# EasyEDA Pro project Dual_ESC_6-24V_3.7A_V1_Easy_EDA.epro

# Schematic Schematic1
Board Name: Board1; Create Date: 2025-12-29; Page Name: P1; Project Name: Dual ESC; Schematic Name: Schematic1; Update Date: 2026-02-05; Company: EasyEDA.com; Page Size: A4; Version: V1.0
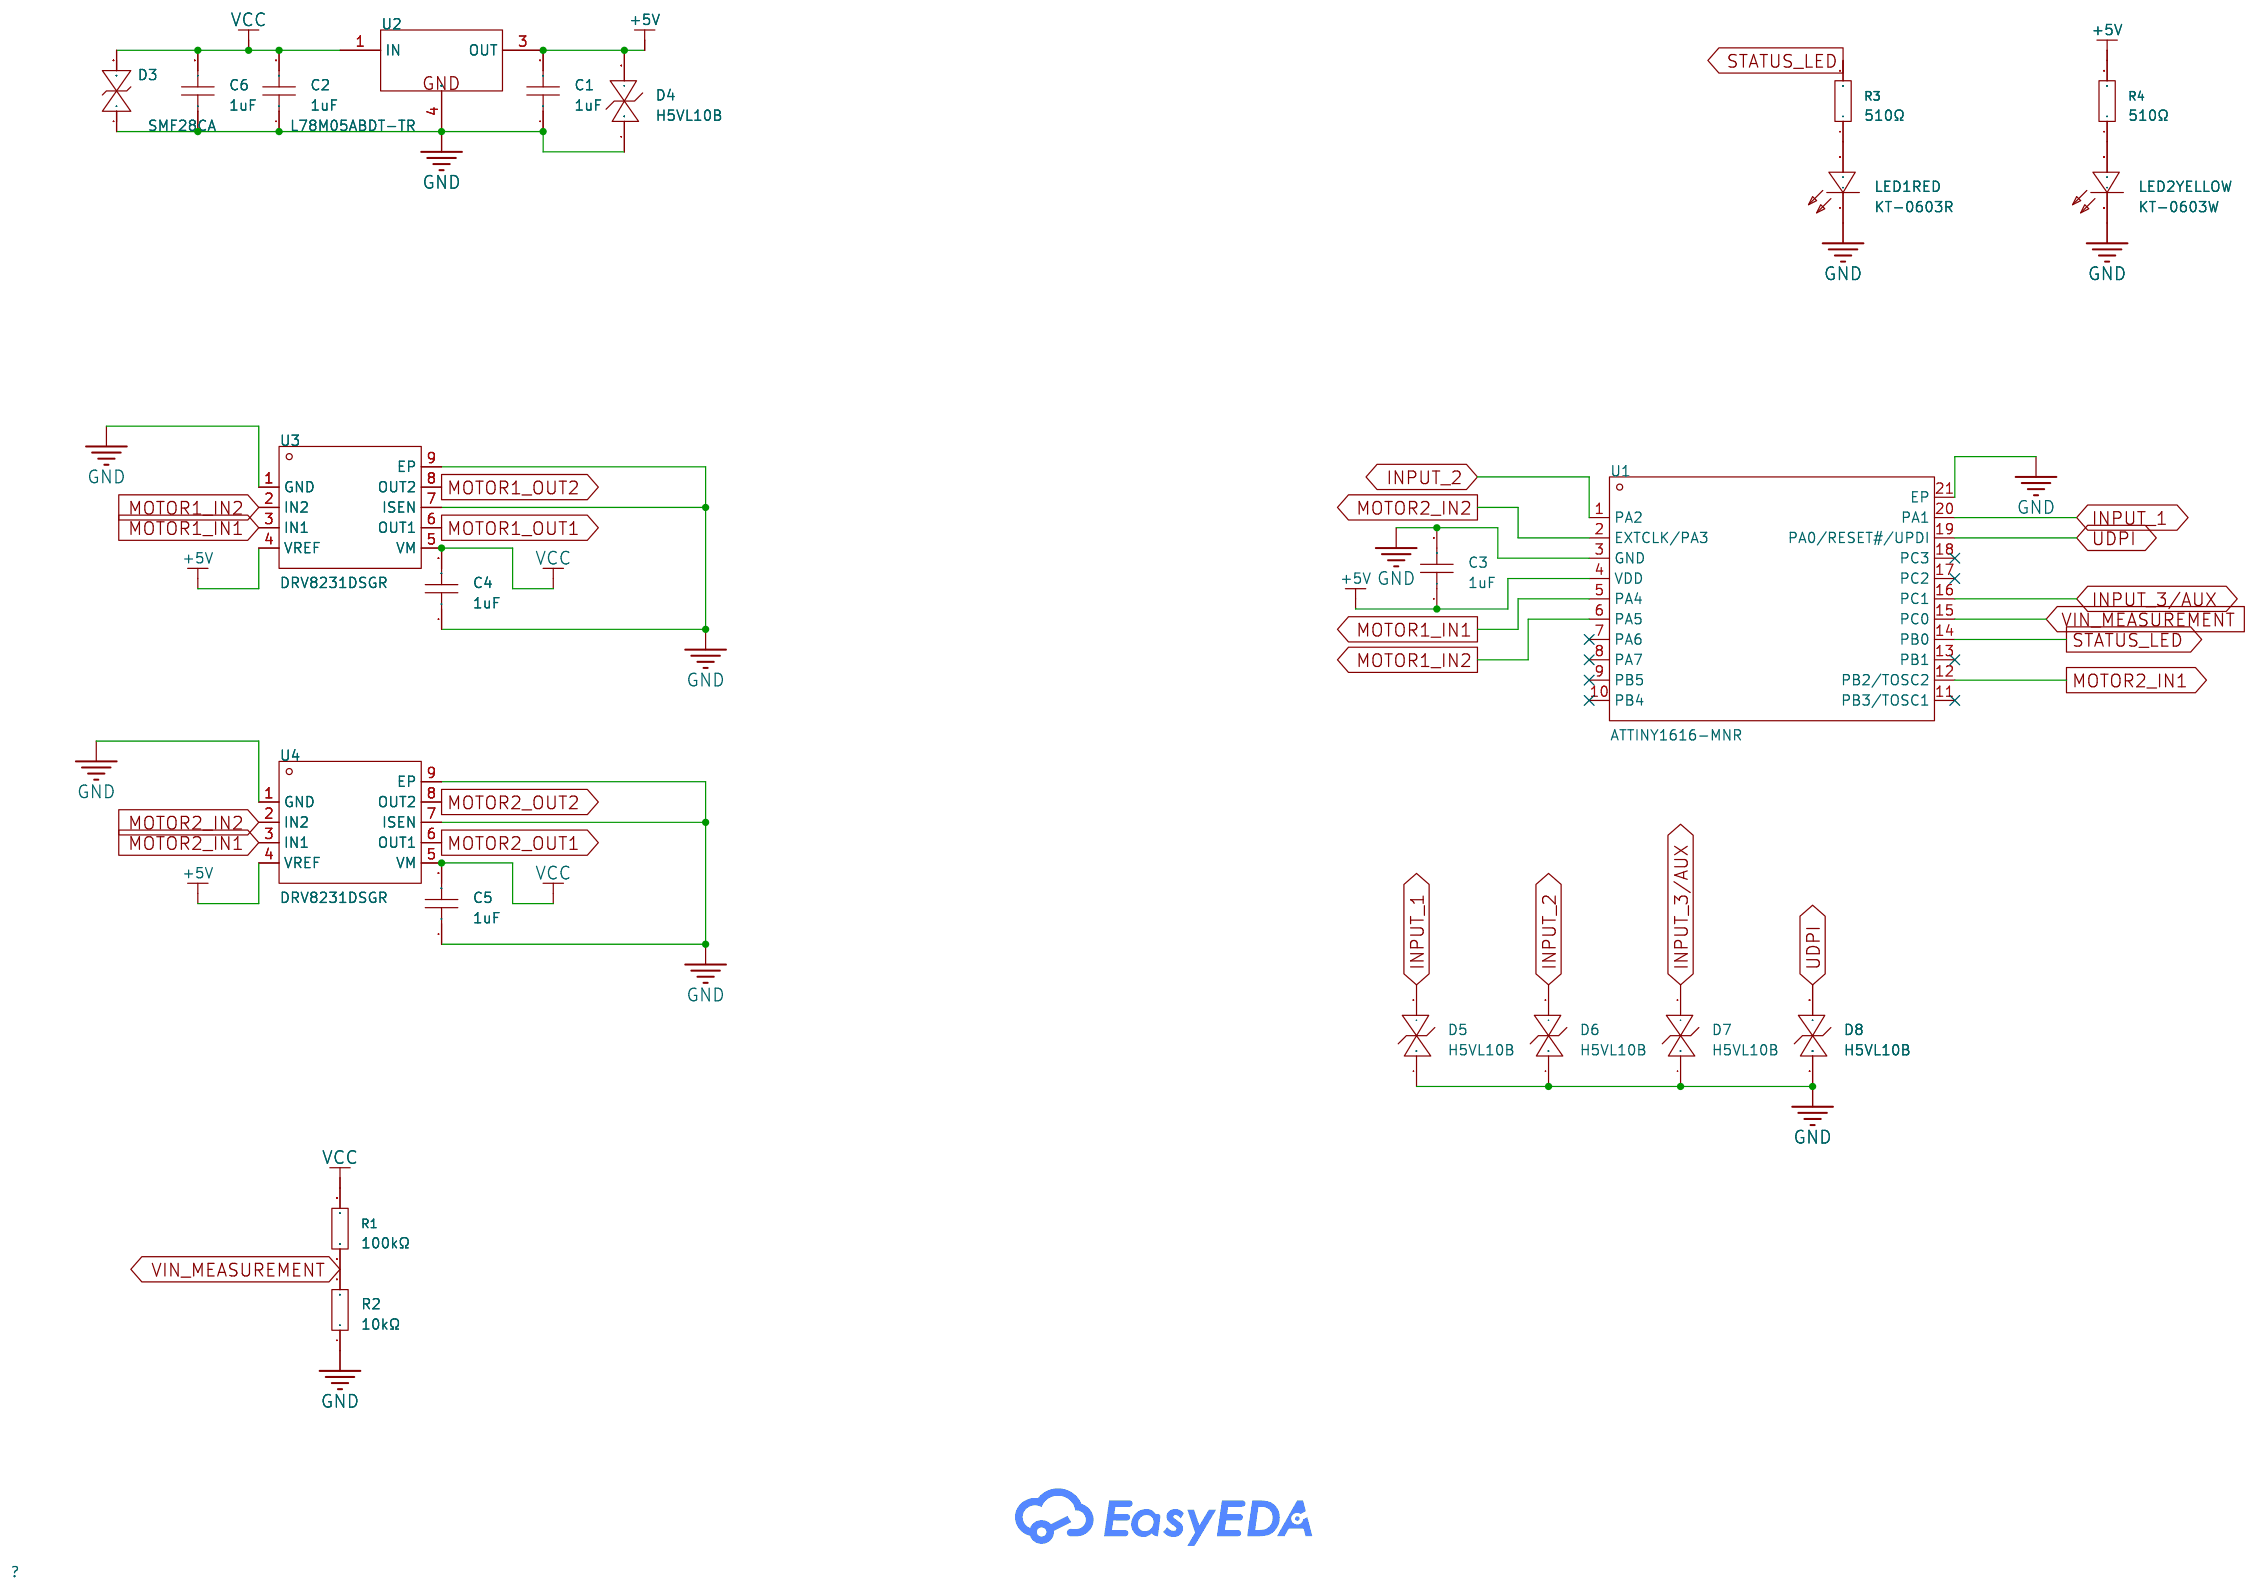
[diagram p0: schematic sheet]

## Parts
C1  1uF  [C0402]
C2  1uF  [C0603]
C3  1uF  [C0402]
C4  1uF  [C0603]
C5  1uF  [C0603]
C6  1uF  [C0603]
D3  SMF28CA  [SOD-123FL_L2.7-W1.8-LS3.8-BI]
D4  H5VL10B  [SOD-882_L1.0-W0.6-BI]
D5  H5VL10B  [SOD-882_L1.0-W0.6-BI]
D6  H5VL10B  [SOD-882_L1.0-W0.6-BI]
D7  H5VL10B  [SOD-882_L1.0-W0.6-BI]
D8  H5VL10B  [SOD-882_L1.0-W0.6-BI]
LED1RED  KT-0603R  [LED0603-RD]
LED2YELLOW  KT-0603W  [LED0603-R-RD_WHITE]
R1  100kΩ  [R0402]
R2  10kΩ  [R0402]
R3  510Ω  [R0402]
R4  510Ω  [R0402]
U1  ATTINY1616-MNR  [QFN-20_L3.0-W3.0-P0.40-BL-EP1.7]
U2  L78M05ABDT-TR  [TO-252-2_L6.5-W6.1-P4.58-LS10.0-TL]
U3  DRV8231DSGR  [WSON-8_L2.0-W2.0-P0.50-TL-EP]
U4  DRV8231DSGR  [WSON-8_L2.0-W2.0-P0.50-TL-EP]

## Library data of the parts
C1 C3 = CL05A105KA5NQNC: Capacitance:1uF Tolerance:±10% Tolerance:±10% Voltage Rating:25V Temperature Coefficient:X5R; LCSC Part Name: 1uF ±10% 25V; Supplier Part: C52923; Manufacturer: SAMSUNG(三星); Supplier Footprint: 0402; JLCPCB Part Class: Basic Part; Datasheet: https://item.szlcsc.com/datasheet/CL05A105KA5NQNC/53938.html; Supplier: LCSC; Tolerance: ±10%; Voltage Rating: 25V; Temperature Coefficient: X5R
C2 C4-C6 = CL10A105KB8NNNC: Capacitance:1uF Tolerance:±10% Tolerance:±10% Voltage Rating:50V Temperature Coefficient:X5R; LCSC Part Name: 1uF ±10% 50V; Supplier Part: C15849; Manufacturer: SAMSUNG(三星); Supplier Footprint: 0603; JLCPCB Part Class: Basic Part; Datasheet: https://item.szlcsc.com/datasheet/CL10A105KB8NNNC/16531.html; Supplier: LCSC; Tolerance: ±10%; Voltage Rating: 50V; Temperature Coefficient: X5R
D3 = SMF28CA_C19077517: Polarity:Bidirectional Reverse Stand-Off Voltage (Vrwm):28V Clamping Voltage:45.4V Peak Pulse Current (Ipp):4.4A@10/1000us Peak Pulse Power Dissipation (Ppp):200W@10/1000us Voltage - Breakdown:34.4V Reverse Leakage Current (Ir):1uA Operating Temperature:-; LCSC Part Name: 双向TVS 28V截止 峰值浪涌电流：4.4A@10/1000us; Supplier Part: C19077517; Manufacturer: R+O(宏嘉诚); Supplier Footprint: SOD-123FL; JLCPCB Part Class: Extended Part; Datasheet: https://item.szlcsc.com/datasheet/SMF28CA/20275602.html; Supplier: LCSC; Polarity: Bidirectional; Reverse Stand-Off Voltage (Vrwm): 28V; Clamping Voltage: 45.4V; Peak Pulse Current (Ipp): 4.4A@10/1000us; Peak Pulse Power Dissipation (Ppp): 200W@10/1000us; Voltage - Breakdown: 34.4V; Reverse Leakage Current (Ir): 1uA; Operating Temperature: -55℃~+150℃; level of protection: IEC 61000-4-2; Type: TVS
D4-D8 = H5VL10B: Polarity:Bidirectional Reverse Stand-Off Voltage (Vrwm):5V Clamping Voltage:10V Peak Pulse Current (Ipp):5A Peak Pulse Power Dissipation (Ppp):50W Voltage - Breakdown:5.6V Reverse Leakage Current (Ir):100nA Number of Channels:1 Operating Temperature:-55℃~; LCSC Part Name: 丝印 PB 双向ESD 5V截止 峰值浪涌电流：5A; Supplier Part: C7420372; Manufacturer: R+O(宏嘉诚); Supplier Footprint: DFN1006-2L; JLCPCB Part Class: Extended Part; Datasheet: https://item.szlcsc.com/datasheet/H5VL10B/8397194.html; Supplier: LCSC; Polarity: Bidirectional; Reverse Stand-Off Voltage (Vrwm): 5V; Clamping Voltage: 10V; Peak Pulse Current (Ipp): 5A; Peak Pulse Power Dissipation (Ppp): 50W; Voltage - Breakdown: 5.6V; Reverse Leakage Current (Ir): 100nA; Number of Channels: 1; Operating Temperature: -55℃~+125℃; level of protection: IEC 61000-4-2；IEC 61000-4-5; Type: ESD; Junction Capacitance: 15pF
LED1RED = KT-0603R: Emitted Color:Red Power Dissipation:- Forward Current:- Dominant Wavelength:- Dominant Wavelength:- Peak Wavelength:- Diode Configuration:- Lens Color:- Color Temperature:- Color Temperature:- Viewing Angle:- Mounting Sytle:- Operating Temperature:-40℃~+8; LCSC Part Name: 0603 红灯 高亮; Supplier Part: C2286; Manufacturer: KENTO; Supplier Footprint: 0603; JLCPCB Part Class: Basic Part; Datasheet: https://atta.szlcsc.com/upload/public/pdf/source/20160616/1466072038404.pdf; Supplier: LCSC; Emitted Color: Red; Operating Temperature: -40℃~+85℃
LED2YELLOW = KT-0603W: Illumination Color:White Voltage - Forward(Vf):2.6V~3.1V Voltage - Forward(Vf):2.6V~3.1V Power(Watts):100mW Forward Current:5mA Diode Configuration:Discrete Diode Lens Color:Yellow Lens Luminous Intensity:360mcd Luminous Intensity:360mcd Viewing Angle:120; LCSC Part Name: 0603 白灯 高亮; Supplier Part: C2290; Manufacturer: KENTO; Supplier Footprint: 0603; JLCPCB Part Class: Basic Part; Datasheet: https://item.szlcsc.com/datasheet/KT-0603W/2663.html; Supplier: LCSC; Illumination Color: White; Voltage - Forward(Vf): 2.6V~3.1V; Power(Watts): 100mW; Forward Current: 5mA; Diode Configuration: Discrete Diode; Lens Color: Yellow Lens; Luminous Intensity: 360mcd; Viewing Angle: 120°; Mounting Style: Top-mount
R1 = 0402WGF1003TCE: Type:Thick Film Resistor Resistance:100kΩ Tolerance:±1% Tolerance:±1% Power(Watts):62.5mW Voltage-Supply(Max):50V Temperature Coefficient:±100ppm/℃ Temperature Coefficient:±100ppm/℃ Operating Temperature:-55℃~+155℃ Operating Temperature:-55℃~+155℃; LCSC Part Name: 100kΩ ±1% 62.5mW 厚膜电阻; Supplier Part: C25741; Manufacturer: UNI-ROYAL(厚声); Supplier Footprint: 0402; JLCPCB Part Class: Basic Part; Datasheet: https://item.szlcsc.com/datasheet/0402WGF1003TCE/26484.html; Supplier: LCSC; Type: Thick Film Resistor; Tolerance: ±1%; Power(Watts): 62.5mW; Voltage-Supply(Max): 50V; Temperature Coefficient: ±100ppm/℃; Operating Temperature: -55℃~+155℃
R2 = 0402WGF1002TCE: Type:Thick Film Resistor Resistance:10kΩ Tolerance:±1% Tolerance:±1% Power(Watts):62.5mW Voltage-Supply(Max):50V Temperature Coefficient:±100ppm/℃ Temperature Coefficient:±100ppm/℃ Operating Temperature:-55℃~+155℃ Operating Temperature:-55℃~+155℃; LCSC Part Name: 10kΩ ±1% 62.5mW 厚膜电阻; Supplier Part: C25744; Manufacturer: UNI-ROYAL(厚声); Supplier Footprint: 0402; JLCPCB Part Class: Basic Part; Datasheet: https://item.szlcsc.com/datasheet/0402WGF1002TCE/26487.html; Supplier: LCSC; Type: Thick Film Resistor; Tolerance: ±1%; Power(Watts): 62.5mW; Voltage-Supply(Max): 50V; Temperature Coefficient: ±100ppm/℃; Operating Temperature: -55℃~+155℃
R3 R4 = 0402WGF5100TCE: Type:Thick Film Resistor Resistance:510Ω Tolerance:±1% Tolerance:±1% Power(Watts):62.5mW Voltage-Supply(Max):50V Temperature Coefficient:±100ppm/℃ Temperature Coefficient:±100ppm/℃ Operating Temperature:-55℃~+155℃ Operating Temperature:-55℃~+155℃; LCSC Part Name: 510Ω ±1% 62.5mW 厚膜电阻; Supplier Part: C25123; Manufacturer: UNI-ROYAL(厚声); Supplier Footprint: 0402; JLCPCB Part Class: Basic Part; Datasheet: https://item.szlcsc.com/datasheet/0402WGF5100TCE/25866.html; Supplier: LCSC; Type: Thick Film Resistor; Tolerance: ±1%; Power(Watts): 62.5mW; Voltage-Supply(Max): 50V; Temperature Coefficient: ±100ppm/℃; Operating Temperature: -55℃~+155℃
U1 = ATTINY1616-MNR: CPU Core:AVR CPU Maximum Speed:20MHz Program Storage Size:16KB Program Memory Type:FLASH Number of I/O:18 ADC (Bit):10bit DAC (Bit):8bit Voltage - Supply:1.8V~5.5V Voltage - Supply:1.8V~5.5V Applications:-; LCSC Part Name: tinyAVR 1系列处理器; Supplier Part: C507118; Manufacturer: MICROCHIP(美国微芯); Supplier Footprint: QFN-20-EP(3x3); JLCPCB Part Class: Extended Part; Datasheet: https://item.szlcsc.com/datasheet/ATTINY1616-MNR/520766.html; Supplier: LCSC; CPU Core: AVR; CPU Maximum Speed: 20MHz; Program Storage Size: 16KB; Program Memory Type: FLASH; Number of I/O: 18; ADC (Bit): 10bit; DAC (Bit): 8bit; Voltage - Supply: 1.8V~5.5V
U2 = L78M05ABDT-TR: Output Type:Fixed Maximum Input Voltage:35V Output Voltage:5V Output Voltage:5V Output Current:500mA Power Supply Rejection Ratio (PSRR):62dB@(120Hz) Dropout Voltage:- standby current:6mA Feature:Short-Circuit  Protection；Thermal Protection(TSD)；Overcurre; LCSC Part Name: 精密500 mA稳压器; Supplier Part: C58069; Manufacturer: ST(意法半导体); Supplier Footprint: TO-252-2(DPAK); JLCPCB Part Class: Basic Part; Datasheet: https://atta.szlcsc.com/upload/public/pdf/source/20230728/311D30A65517FCBD6FE5D1CCA2CA8430.pdf; Supplier: LCSC; Output Type: Fixed; Maximum Input Voltage: 35V; Output Voltage: 5V; Output Current: 500mA; Power Supply Rejection Ratio (PSRR): 62dB@(120Hz); standby current: 6mA; Feature: Short-Circuit  Protection；Thermal Protection(TSD)；Overcurrent Protection(OCP); Operating Temperature: -40℃~+125℃; Output Polarity: Positive electrode; Number of Outputs: 1
U3 U4 = DRV8231DSGR: Technology:Yes Number of H-bridges:1 Peak Current:3.7A Voltage - Supply:4.5V~33V Voltage - Supply:4.5V~33V RDS(on):600mΩ Quiescent Current(Iq):1uA Operating Temperature:-40℃~+125℃ Operating Temperature:-40℃~+125℃; LCSC Part Name: 3.7A 有刷直流电机驱动芯片 33V; Supplier Part: C3681197; Manufacturer: TI(德州仪器); Supplier Footprint: WSON-8(2x2); JLCPCB Part Class: Extended Part; Datasheet: https://www.ti.com/cn/lit/gpn/drv8231; Supplier: LCSC; Technology: Yes; Number of H-bridges: 1; Peak Current: 3.7A; Voltage - Supply: 4.5V~33V; RDS(on): 600mΩ; Quiescent Current(Iq): 1uA; Operating Temperature: -40℃~+125℃

## Nets
+5V: C1.2 C3.1 D4.2(A) R4.2 U1.4(VDD) U2.3(OUT) U3.4(VREF) U4.4(VREF)
GND: C1.1 C2.1 C3.2 C4.1 C5.1 C6.1 D3.1 D4.1(C) D5.1(C) D6.1(C) D7.1(C) D8.1(C) LED1RED.1(K) LED2YELLOW.2(K) R2.1 U1.3(GND) U1.21(EP) U2.4(GND) U3.1(GND) U3.7(ISEN) U3.9(EP) U4.1(GND) U4.7(ISEN) U4.9(EP)
VCC: C2.2 C4.2 C5.2 C6.2 D3.2 R1.2 U2.1(IN) U3.5(VM) U4.5(VM)
VIN_MEASUREMENT: R1.1 R2.2 U1.15(PC0)
INPUT_1: D5.2(A) U1.20(PA1)
INPUT_2: D6.2(A) U1.1(PA2)
INPUT_3/AUX: D7.2(A) U1.16(PC1)
MOTOR1_IN1: U1.5(PA4) U3.3(IN1)
MOTOR1_IN2: U1.6(PA5) U3.2(IN2)
MOTOR1_OUT1: U3.6(OUT1)
MOTOR1_OUT2: U3.8(OUT2)
MOTOR2_IN1: U1.12(PB2/TOSC2) U4.3(IN1)
MOTOR2_IN2: U1.2(EXTCLK/PA3) U4.2(IN2)
MOTOR2_OUT1: U4.6(OUT1)
MOTOR2_OUT2: U4.8(OUT2)
STATUS_LED: R3.2 U1.14(PB0)
UDPI: D8.2(A) U1.19(PA0/RESET#/UPDI)
$1N1764: LED1RED.2(A) R3.1
$1N1846: LED2YELLOW.1(A) R4.1

Not connected (* = marked no-connect by the designer): U1 7(PA6)* 8(PA7)* 9(PB5)* 10(PB4)* 11(PB3/TOSC1)* 13(PB1)* 17(PC2)* 18(PC3)*

# Board PCB1
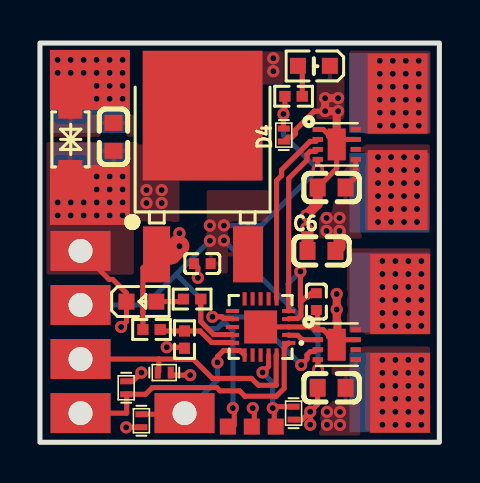
[diagram p1: board, top side]
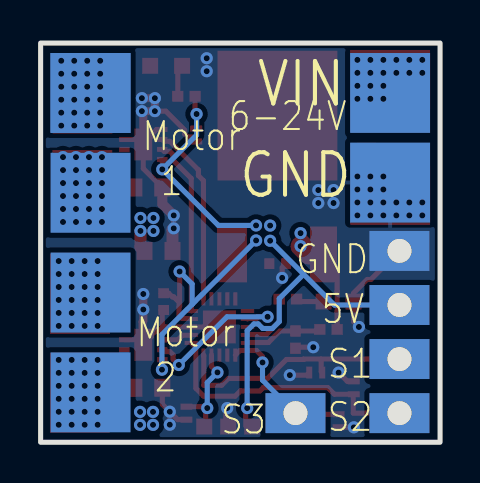
[diagram p2: board, bottom side, seen from below]

Outline 20 x 20 mm; copper layers: Top Layer, Inner1, Inner2, Bottom Layer. Coordinates in mm from the lower left corner of the outline.
Outline path: rectangle 0,20 20,0
Stack: Top Layer 0.035mm Outer layer thickness 1oz / Dielectric1 0.2104mm 7628 RC49% 8.6mil / Inner1 0.0152mm Inner layer thickness / Dielectric2 1.065mm 1.1mm H/HOZ Copper / Inner2 0.0152mm Inner layer thickness / Dielectric3 0.2104mm 7628 RC49% 8.6mil / Bottom Layer 0.035mm Outer layer thickness 1oz

## Design rules (mm)
template: Custom Config
spacing copperThickness1oz (default): track to track 0.102, other pairs 0.152 to 0.3
spacing copperThickness2oz: track to track 0.203, other pairs 0.152 to 0.3
track width copperThickness1oz (default): min 0.127, default 0.254, max 2.54
track width copperThickness2oz: min 0.203, default 0.254, max 2.54
differential pair differentialPair (default): width min 0.127, default 0.254, max 2.54; gap min 0.152, default 0.152
via viaSize (default): diameter min 0.5, default 0.61, max 10; hole min 0.3, default 0.305, max 6.3
net MOTOR1_OUT1 uses Motor_Outputs
net MOTOR1_OUT2 uses Motor_Outputs
net MOTOR2_OUT1 uses Motor_Outputs
net MOTOR2_OUT2 uses Motor_Outputs
pour e164 uses Motor_Outputs
pour e17 uses Motor_Outputs

## Placement (name value [footprint] x y rotation side)
C1  1uF  [C0402]  8.13 8.95 0 top
C2  1uF  [C0603]  3.68 15.3 90 top
C3  1uF  [C0402]  13.84 7.05 270 top
C4  1uF  [C0603]  14.6 12.76 0 top
C5  1uF  [C0603]  14.6 2.73 0 top
C6  1uF  [C0603]  14.1 9.59 0 top
D3  SMF28CA  [SOD-123FL_L2.7-W1.8-LS3.8-BI]  1.52 15.17 90 top
D4  H5VL10B  [SOD-882_L1.0-W0.6-BI]  12.21 15.39 90 top
D5  H5VL10B  [SOD-882_L1.0-W0.6-BI]  6.22 3.49 180 top
D6  H5VL10B  [SOD-882_L1.0-W0.6-BI]  4.32 2.73 270 top
D7  H5VL10B  [SOD-882_L1.0-W0.6-BI]  5.08 1.08 90 top
D8  H5VL10B  [SOD-882_L1.0-W0.6-BI]  12.7 1.46 90 top
LED1RED  KT-0603R  [LED0603-RD]  5.08 7.05 0 top
LED2YELLOW  KT-0603W  [LED0603-R-RD_WHITE]  13.72 18.86 180 top
NOREF  -  [Pad_e862]  17.91 12.63 0 top
NOREF#2  -  [Pad_e148]  2.03 9.59 0 top
NOREF#3  -  [Pad_e894]  9.41 0.78 0 top
NOREF#4  -  [Pad_e864]  18.03 2.47 0 top
NOREF#5  -  [Pad_e143]  17.5 12.5 0 top
NOREF#6  -  [Pad_e145]  17.5 7.5 0 top
NOREF#7  -  [Pad_e144]  17.5 2.5 0 top
NOREF#8  -  [Pad_e863]  18.03 7.43 0 top
NOREF#9  -  [Pad_e153]  2.03 4.17 0 top
NOREF#10  -  [Pad_e513]  2.5 18.16 0 top
NOREF#11  -  [Pad_e141]  17.5 17.5 0 top
NOREF#12  -  [Pad_e152]  2.03 6.88 0 top
NOREF#13  -  [Pad_e896]  10.61 0.78 0 top
NOREF#14  -  [Pad_e146]  2.5 17.5 0 top
NOREF#15  -  [Pad_e897]  11.81 0.78 0 top
NOREF#16  -  [Pad_e155]  7.24 1.46 0 top
NOREF#17  -  [Pad_e154]  2.03 1.46 0 top
NOREF#18  -  [Pad_e847]  17.5 17.5 0 top
NOREF#19  -  [Pad_e147]  2.5 13.01 0 top
NOREF#20  -  [Pad_e861]  17.91 17.46 0 top
NOREF#21  -  [Pad_e515]  2.5 12.39 0 top
R1  100kΩ  [R0402]  5.59 5.65 180 top
R2  10kΩ  [R0402]  7.24 5.14 90 top
R3  510Ω  [R0402]  7.62 7.17 0 top
R4  510Ω  [R0402]  12.7 17.33 180 top
U1  ATTINY1616-MNR  [QFN-20_L3.0-W3.0-P0.40-BL-EP1.7]  11.05 5.78 90 top
U2  L78M05ABDT-TR  [TO-252-2_L6.5-W6.1-P4.58-LS10.0-TL]  8.13 12.89 90 top
U3  DRV8231DSGR  [WSON-8_L2.0-W2.0-P0.50-TL-EP]  14.86 14.92 0 top
U4  DRV8231DSGR  [WSON-8_L2.0-W2.0-P0.50-TL-EP]  14.86 4.89 0 top

## Footprints (pads in the part's own frame, mm; a bottom-side part is the same pattern mirrored in y, then rotated)
C0402
  rect 0.5x0.54 smd: 1(-0.42,0) 2(0.42,0)
C0603
  rect 0.8x0.9 smd: 1(-0.7,0) 2(0.7,0)
LED0603-R-RD_WHITE
  rect 0.8x0.8 smd: 1(0.8,0) 2(-0.8,0)
LED0603-RD
  rect 0.8x0.8 smd: 1(-0.749,0) 2(0.749,0)
Pad_e141
  rect 4x4 smd far side: 1(0,0)
Pad_e143
  rect 4x4 smd far side: 1(0,0)
Pad_e144
  rect 4x4 smd far side: 1(0,0)
Pad_e145
  rect 4x4 smd far side: 1(0,0)
Pad_e146
  rect 4x4 smd far side: 1(0,0)
Pad_e147
  rect 4x4 smd far side: 1(0,0)
Pad_e148
  rect 3x2 hole 1.2: 1(0,0)
Pad_e152
  rect 3x2 hole 1.2: 1(0,0)
Pad_e153
  rect 3x2 hole 1.2: 1(0,0)
Pad_e154
  rect 3x2 hole 1.2: 1(0,0)
Pad_e155
  rect 3x2 hole 1.2: 1(0,0)
Pad_e513
  rect 4x3 smd: 1(0,0)
Pad_e515
  rect 4x3 smd: 1(0,0)
Pad_e847
  rect 4x4 smd far side: 1(0,0)
Pad_e861
  rect 3x4 smd: 1(0,0)
Pad_e862
  rect 3x4 smd: 2(0,0)
Pad_e863
  rect 3x4 smd: 3(0,0)
Pad_e864
  rect 3x4 smd: 4(0,0)
Pad_e894
  rect 0.8x0.8 smd: 1(0,0)
Pad_e896
  rect 0.8x0.8 smd: 1(0,0)
Pad_e897
  rect 0.8x0.8 smd: 1(0,0)
QFN-20_L3.0-W3.0-P0.40-BL-EP1.7
  rect 0.2x0.665 smd: 1(-0.8,-1.407) 2(-0.4,-1.407) 3(0,-1.407) 4(0.4,-1.407) 5(0.8,-1.407) 11(0.8,1.407) 12(0.4,1.407) 13(0,1.407) 14(-0.4,1.407) 15(-0.8,1.407)
  rect 0.665x0.2 smd: 6(1.407,-0.8) 7(1.407,-0.4) 8(1.407,0) 9(1.407,0.4) 10(1.407,0.8) 16(-1.407,0.8) 17(-1.407,0.4) 18(-1.407,0) 19(-1.407,-0.4) 20(-1.407,-0.8)
  rect 1.65x1.65 smd: 21(0,0)
R0402
  rect 0.566x0.54 smd: 1(-0.433,0) 2(0.433,0)
SOD-123FL_L2.7-W1.8-LS3.8-BI
  rect 1.4x1.2 smd: 1(-1.735,0) 2(1.735,0)
SOD-882_L1.0-W0.6-BI
  rect 0.3x0.6 smd: 1(-0.325,0) 2(0.325,0)
TO-252-2_L6.5-W6.1-P4.58-LS10.0-TL
  rect 2.8x1.35 smd: 1(-3.475,2.29)
  rect 2.8x1.5 smd: 3(-3.475,-2.29)
  rect 6.5x6 smd: 4(3.475,-0.017)
WSON-8_L2.0-W2.0-P0.50-TL-EP
  rect 0.521x0.25 smd: 1(-0.95,0.75) 2(-0.95,0.25) 3(-0.95,-0.25) 4(-0.95,-0.75) 5(0.95,-0.75) 6(0.95,-0.25) 7(0.95,0.25) 8(0.95,0.75)
  rect 0.9x1.6 smd: 9(0,0)

## Nets
+5V: C1.2 C3.1 D4.2 NOREF#3.1 NOREF#12.1 R4.2 U1.4 U2.3 U3.4 U4.4
GND: C1.1 C2.1 C3.2 C4.1 C5.1 C6.1 D3.1 D4.1 D5.1 D6.1 D7.1 D8.1 LED1RED.1 LED2YELLOW.2 NOREF#2.1 NOREF#13.1 NOREF#19.1 NOREF#21.1 R2.1 U1.3 U1.21 U2.4 U3.1 U3.7 U3.9 U4.1 U4.7 U4.9
VCC: C2.2 C4.2 C5.2 C6.2 D3.2 NOREF#10.1 NOREF#14.1 R1.2 U2.1 U3.5 U4.5
VIN_MEASUREMENT: R1.1 R2.2 U1.15
INPUT_1: D5.2 NOREF#9.1 U1.20
INPUT_2: D6.2 NOREF#17.1 U1.1
INPUT_3/AUX: D7.2 NOREF#16.1 U1.16
MOTOR1_IN1: U1.5 U3.3
MOTOR1_IN2: U1.6 U3.2
MOTOR1_OUT1: NOREF.2 NOREF#5.1 U3.6
MOTOR1_OUT2: NOREF#11.1 NOREF#18.1 NOREF#20.1 U3.8
MOTOR2_IN1: U1.12 U4.3
MOTOR2_IN2: U1.2 U4.2
MOTOR2_OUT1: NOREF#4.4 NOREF#7.1 U4.6
MOTOR2_OUT2: NOREF#6.1 NOREF#8.3 U4.8
STATUS_LED: R3.2 U1.14
UDPI: D8.2 NOREF#15.1 U1.19
$1N1764: LED1RED.2 R3.1
$1N1846: LED2YELLOW.1 R4.1

Pads without a net: U1 7 8 9 10 11 13 17 18

## Via types
v1: diameter 0.61, hole 0.305, Top Layer to Bottom Layer, 179 vias

## Routing (per net, layer and track width the routed paths; a pad name or vN(x,y) marks a point on that pad's centre or on a via; arc(x,y) is an arc through that point)
+5V: length 44
  Top Layer w0.254: D4.2 12.19,15.73 v1(12.19,16.44) 12.27,16.52 R4.2 ; v1(13.93,3.64) 13.93,4.12 13.91,4.14 ; 13.97,7.47 13.59,7.47 13.41,7.28 13.33,7.28 13.07,7.02 13.07,6.36 12.9,6.2 12.48,6.2 U1.4 ; v1(13.04,8.55) 13.04,6.82 13.07,6.79 ; 9.73,0.82 9.73,1.64 v1(9.66,1.71) ; v1(13.91,13.67) 13.91,14.17
  Bottom Layer w0.254: v1(9.21,10.86) 11.1,10.86 v1(13.91,13.67) 12.19,15.39 v1(12.19,16.44) ; 12.41,6.91 12.41,7.93 v1(13.04,8.55) ; 12.41,6.91 13.93,5.4 v1(13.93,3.64) ; 12.41,6.91 v1(9.21,10.11) ; v1(9.66,1.71) 9.66,5.59 9.32,5.93 9.11,5.93 8.88,5.7 8.39,5.7 8.05,6.04 8.05,7.2 6.83,8.42 ; 6.83,8.42 5.29,6.88 NOREF#12.1 ; 6.83,8.42 v1(8.51,10.09)
  vias: v1(8.51,10.86)
GND: length 36.7
  Top Layer w0.254: U3.9 15.11,15.17 U3.7 ; U3.9 14.86,13.72 C4.1 ; U3.9 14.45,15.33 14.45,15.41 14.19,15.67 13.91,15.67 ; U4.9 14.45,5.3 14.45,5.38 14.19,5.64 13.91,5.64 ; C5.1 13.91,1.9 v1(13.53,1.53) ; U4.7 15.11,5.14 ; C1.1 7.91,8.75 v1(7.91,8.24) ; v1(14.28,16.59) 13.73,16.59 12.79,15.64 12.79,15.45 12.63,15.29 12.43,15.29 D4.1 ; v1(13.53,1.53) 13.14,1.13 D8.1 ; v1(13.53,1.53) v1(13.53,0.88) ; v1(10.66,1.71) 10.73,1.64 10.73,0.82 ; v1(4.32,0.75) 5.07,0.75 D7.1 ; R2.1 7.19,4.76 v1(6.35,4.76) ; 13.91,5.64 13.91,6.56 13.97,6.63 ; 13.91,5.64 13.77,5.78 U1.3 U1.21 ; v1(13.34,11.36) v1(13.34,10.71) ; D5.1 6.68,3.36 v1(7.52,3.36) ; v1(4.06,5.78) 4.33,6.04 LED1RED.1 4.33,7.47 3.65,8.16 3.46,8.16 NOREF#2.1 ; D6.1 4.64,3.05 v1(5.08,3.49)
  Top Layer w0.4: U4.9 14.9,4.92 14.9,6.03 14.86,6.07 v1(14.86,6.65) v1(14.86,7.43) ; v1(14.93,17.24) v1(14.28,17.24) v1(14.28,16.59) v1(14.93,16.59) 14.86,16.52 U3.9
  Top Layer w0.5: C4.1 13.91,11.93 v1(13.34,11.36)
  Top Layer w0.6: v1(13.34,10.71) 13.4,10.65 13.4,9.59
  vias: v1(0.89,12.01) v1(0.89,11.36) v1(1.54,12.01) v1(1.54,11.36) v1(2.19,12.01) v1(2.19,11.36) v1(2.84,13.31) v1(2.84,12.66) v1(2.84,12.01) v1(2.84,11.36) v1(3.49,13.31) v1(3.49,12.66) v1(3.49,12.01) v1(3.49,11.36) v1(4.14,13.31) v1(4.14,12.66) v1(4.14,12.01) v1(4.14,11.36) v1(5.33,12.63) v1(5.33,11.98) v1(6.1,12.63) v1(6.1,11.98) v1(11.68,19.24) v1(11.68,18.59)
VCC: length 9.5
  Top Layer w0.254: 5.92,9.41 v1(6.99,10.47) ; U3.5 15.81,13.27 C4.2 ; 5.84,9.41 5.16,8.73 5.16,7.57 5.15,7.56 5.15,6.53 5.16,6.53 R1.2
  Top Layer w0.6: C6.2 15,9.79 v1(15,10.59)
  Top Layer w1: 5.92,9.41 6.57,9.41 v1(6.99,9.83)
  vias: v1(0.89,19.16) v1(0.89,18.51) v1(1.54,19.16) v1(1.54,18.51) v1(2.19,19.16) v1(2.19,18.51) v1(2.84,19.16) v1(2.84,18.51) v1(2.84,17.86) v1(2.84,17.21) v1(3.49,19.16) v1(3.49,18.51) v1(3.49,17.86) v1(3.49,17.21) v1(4.14,19.16) v1(4.14,18.51) v1(4.14,17.86) v1(4.14,17.21) v1(14.35,11.24) v1(14.35,10.59) v1(14.37,1.52) v1(14.37,0.87) v1(15,11.24) v1(15.02,1.52) v1(15.02,0.87)
VIN_MEASUREMENT: length 3.9
  Top Layer w0.254: R1.1 6.1,5.57 R2.2 8.02,5.57 8.59,5 9.62,5 U1.15
INPUT_1: length 12.6
  Top Layer w0.254: 11.85,4.37 11.83,4.35 11.83,2.86 10.94,2.86 10.59,3.2 8.64,3.2 7.69,4.15 6.85,4.15 6.83,4.17 5.95,4.17 ; D5.2 5.95,3.54 5.95,4.17 ; 5.95,4.17 NOREF#9.1
INPUT_2: length 14
  Top Layer w0.254: NOREF#17.1 4.34,1.46 4.34,2.38 4.32,2.4 5.29,2.4 5.62,2.74 8.85,2.74 9.02,2.57 10,2.57 10.26,2.31 11.83,2.31 12.23,2.7 12.23,4.75 U1.1
INPUT_3/AUX: length 7.3
  Top Layer w0.254: D7.2 7.18,1.4 NOREF#16.1 ; v1(8.89,4) 8.89,4.29 9.19,4.6 10.02,4.6 U1.16
  Bottom Layer w0.254: v1(8.89,4) 8.89,3.11 NOREF#16.1
MOTOR1_IN1: length 8.9
  Top Layer w0.254: 13.91,14.67 13.81,14.57 13.53,14.57 13.37,14.41 13.37,14.13 12.46,13.22 U1.5
MOTOR1_IN2: length 9
  Top Layer w0.254: 13.91,15.17 13.81,15.07 13.53,15.07 12.1,13.64 12.1,13.36 11.85,13.11 11.85,7.18
MOTOR1_OUT1:
  vias: v1(16.93,14.28) v1(16.93,13.64) v1(16.93,12.98) v1(16.93,12.33) v1(16.93,11.69) v1(16.93,11.03) v1(17.58,14.28) v1(17.58,13.64) v1(17.58,12.98) v1(17.58,12.33) v1(17.58,11.69) v1(17.58,11.03) v1(18.23,14.28) v1(18.23,13.64) v1(18.23,12.98) v1(18.23,12.33) v1(18.23,11.69) v1(18.23,11.03) v1(18.88,14.28) v1(18.88,13.64) v1(18.88,12.98) v1(18.88,12.33) v1(18.88,11.69) v1(18.88,11.03)
MOTOR1_OUT2:
  vias: v1(17.02,19.11) v1(17.02,18.46) v1(17.02,17.81) v1(17.02,17.16) v1(17.02,16.51) v1(17.02,15.86) v1(17.67,19.11) v1(17.67,18.46) v1(17.67,17.81) v1(17.67,17.16) v1(17.67,16.51) v1(17.67,15.86) v1(18.32,19.11) v1(18.32,18.46) v1(18.32,17.81) v1(18.32,17.16) v1(18.32,16.51) v1(18.32,15.86) v1(18.97,19.11) v1(18.97,18.46) v1(18.97,17.81) v1(18.97,17.16) v1(18.97,16.51) v1(18.97,15.86)
MOTOR2_IN1: length 7.8
  Top Layer w0.254: U1.12 9.62,6.2 9.19,6.2 9.11,6.28 v1(8.64,6.28) ; v1(13.08,3.87) 13.37,4.16 13.37,4.38 13.53,4.54 13.75,4.54 13.85,4.64 13.91,4.64
  Bottom Layer w0.254: v1(8.64,6.28) 10.67,6.28 v1(13.08,3.87)
MOTOR2_IN2: length 1.6
  Top Layer w0.254: 13.91,5.14 13.12,5.14 12.9,5.36 12.48,5.36 U1.2
MOTOR2_OUT1:
  vias: v1(17.15,4.12) v1(17.15,3.47) v1(17.15,2.83) v1(17.15,2.17) v1(17.15,1.53) v1(17.15,0.88) v1(17.79,4.12) v1(17.79,3.47) v1(17.79,2.83) v1(17.79,2.17) v1(17.79,1.53) v1(17.79,0.88) v1(18.44,4.12) v1(18.44,3.47) v1(18.44,2.83) v1(18.44,2.17) v1(18.44,1.53) v1(18.44,0.88) v1(19.09,4.12) v1(19.09,3.47) v1(19.09,2.83) v1(19.09,2.17) v1(19.09,1.53) v1(19.09,0.88)
MOTOR2_OUT2:
  vias: v1(17.15,9.08) v1(17.15,8.43) v1(17.15,7.78) v1(17.15,7.13) v1(17.15,6.48) v1(17.15,5.83) v1(17.79,9.08) v1(17.79,8.43) v1(17.79,7.78) v1(17.79,7.13) v1(17.79,6.48) v1(17.79,5.83) v1(18.44,9.08) v1(18.44,8.43) v1(18.44,7.78) v1(18.44,7.13) v1(18.44,6.48) v1(18.44,5.83) v1(19.09,9.08) v1(19.09,8.43) v1(19.09,7.78) v1(19.09,7.13) v1(19.09,6.48) v1(19.09,5.83)
STATUS_LED: length 3
  Top Layer w0.254: R3.2 8.05,6.04 8.7,5.4 9.62,5.4 U1.14
UDPI: length 5
  Top Layer w0.254: D8.2 11.73,1.78 v1(11.66,1.71) 11.73,1.64 11.73,0.82 ; U1.19 11.45,3.8 v1(11.15,3.5)
  Bottom Layer w0.254: v1(11.15,3.5) 11.66,2.99 v1(11.66,1.71)
$1N1764: length 1.4
  Top Layer w0.254: R3.1 7.06,7.05 LED1RED.2
$1N1846: length 1.6
  Top Layer w0.254: LED2YELLOW.1 13.13,18.64 R4.1

## Copper pours and planes (outline as drawn; the poured copper is in the pictures)
+5V on Top Layer: 8.35,12.63 11.43,12.63 11.43,8.45 8.35,8.45
GND on Top Layer: 6.99,11.03 6.99,14.92 4.95,14.92 4.83,15.05 0.33,15.05 0.33,8.4 4.7,8.4 4.7,11.03
GND on Top Layer: 9.27,19.58 12.19,19.58 12.19,17.93 9.27,17.93
GND on Top Layer: 13.86,19.6 15.37,19.6 15.37,16.19 13.86,16.19
GND on Top Layer: 0.38,15.02 4.63,15.02 4.63,8.44 0.38,8.44
GND on Bottom Layer: 0,20 20,20 20,0 0,0
GND on Inner1: 0.13,20 20.13,20 20.13,0 0.13,0
VCC on Top Layer: 16.13,14.41 15.49,14.41 15.49,13.93 14.89,13.26 14.62,11.56 13.97,11.26 13.97,10.2 16.02,10.2 16.13,10.09
VCC on Top Layer: 15.49,4.38 16.13,4.38 16.13,0.34 13.97,0.34 13.97,1.44 14.6,2.02 14.6,3.74 14.73,3.87 15.48,3.87 15.49,3.89
VCC on Top Layer: 0.49,19.75 4.7,19.75 4.7,15.3 0.49,15.3
VCC on Inner2: 0,20.13 20,20.13 20,0.13 0,0.13
MOTOR1_OUT1 on Top Layer: 19.52,10.64 19.56,10.6 16.28,10.6 16.28,14.44 16.26,14.54 15.49,14.54 15.49,14.92 15.49,14.92 19.52,14.92
MOTOR1_OUT2 on Top Layer: 15.49,19.62 19.56,19.62 19.56,15.43 15.49,15.43
MOTOR2_OUT1 on Top Layer: 19.52,0.6 19.56,0.57 16.28,0.57 16.28,4.41 16.26,4.51 15.49,4.51 15.49,4.8 19.53,4.8
MOTOR2_OUT2 on Top Layer: 15.37,9.71 19.56,9.71 19.56,5.39 15.37,5.39

## Text on the board
Bottom Silkscreen Layer: S1 | S2 | 5V | GND | 6-24V | S3 | Motor / 1 | Motor / 2 | VIN
